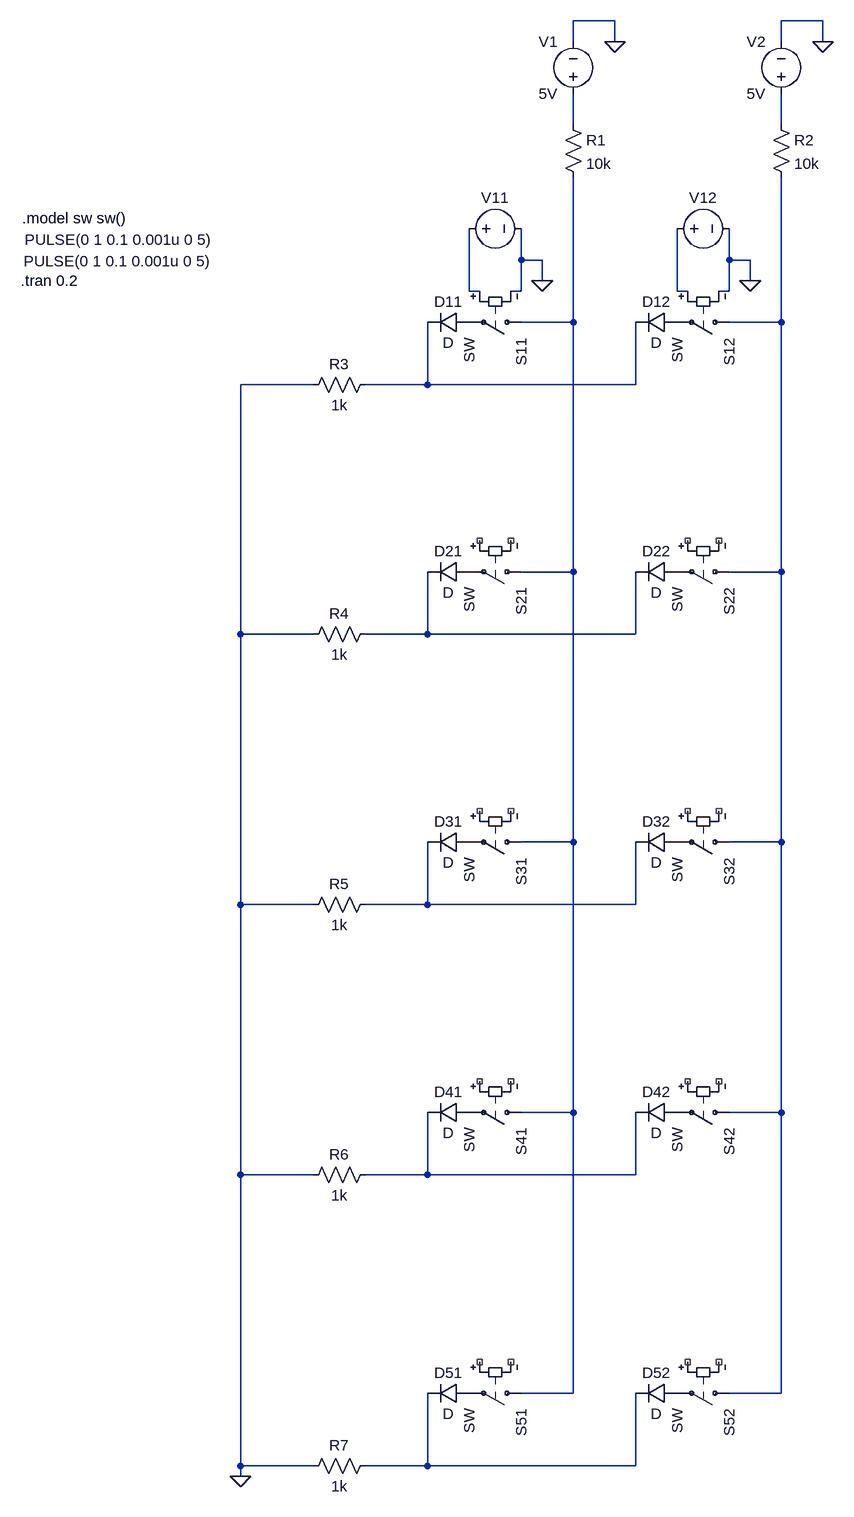
[diagram p0: schematic BGK.asc]
BGK.asc, the LTspice schematic file:
Version 4
SHEET 1 880 2072
WIRE 304 -224 240 -224
WIRE 624 -224 560 -224
WIRE 240 -192 240 -224
WIRE 304 -192 304 -224
WIRE 560 -192 560 -224
WIRE 624 -192 624 -224
WIRE 240 -64 240 -112
WIRE 560 -64 560 -112
WIRE 160 144 160 96
WIRE 192 144 160 144
WIRE 480 144 480 96
WIRE 512 144 480 144
WIRE 192 176 192 144
WIRE 512 176 512 144
WIRE 80 192 80 96
WIRE 96 192 80 192
WIRE 160 192 160 144
WIRE 160 192 144 192
WIRE 400 192 400 96
WIRE 416 192 400 192
WIRE 480 192 480 144
WIRE 480 192 464 192
WIRE 240 240 240 16
WIRE 240 240 160 240
WIRE 560 240 560 16
WIRE 560 240 480 240
WIRE -160 336 -272 336
WIRE 16 336 16 240
WIRE 16 336 -80 336
WIRE 336 336 336 240
WIRE 336 336 16 336
WIRE 240 624 240 240
WIRE 240 624 160 624
WIRE 560 624 560 240
WIRE 560 624 480 624
WIRE -272 720 -272 336
WIRE -160 720 -272 720
WIRE 16 720 16 624
WIRE 16 720 -80 720
WIRE 336 720 336 624
WIRE 336 720 16 720
WIRE 240 1040 240 624
WIRE 240 1040 160 1040
WIRE 560 1040 560 624
WIRE 560 1040 480 1040
WIRE -272 1136 -272 720
WIRE -160 1136 -272 1136
WIRE 16 1136 16 1040
WIRE 16 1136 -80 1136
WIRE 336 1136 336 1040
WIRE 336 1136 16 1136
WIRE 240 1456 240 1040
WIRE 240 1456 160 1456
WIRE 560 1456 560 1040
WIRE 560 1456 480 1456
WIRE -272 1552 -272 1136
WIRE -160 1552 -272 1552
WIRE 16 1552 16 1456
WIRE 16 1552 -80 1552
WIRE 336 1552 336 1456
WIRE 336 1552 16 1552
WIRE 240 1888 240 1456
WIRE 240 1888 160 1888
WIRE 560 1888 560 1456
WIRE 560 1888 480 1888
WIRE -272 2000 -272 1552
WIRE -160 2000 -272 2000
WIRE 16 2000 16 1888
WIRE 16 2000 -80 2000
WIRE 336 2000 336 1888
WIRE 336 2000 16 2000
WIRE -272 2016 -272 2000
FLAG 304 -192 0
FLAG 624 -192 0
FLAG -272 2016 0
FLAG 192 176 0
FLAG 512 176 0
SYMBOL voltage 240 -96 R180
WINDOW 0 24 96 Left 2
WINDOW 3 24 16 Left 2
WINDOW 123 0 0 Left 0
WINDOW 39 0 0 Left 0
SYMATTR InstName V1
SYMATTR Value 5V
SYMBOL diode 80 224 R90
WINDOW 0 0 32 VBottom 2
WINDOW 3 32 32 VTop 2
SYMATTR InstName D11
SYMBOL diode 80 608 R90
WINDOW 0 0 32 VBottom 2
WINDOW 3 32 32 VTop 2
SYMATTR InstName D21
SYMBOL diode 80 1024 R90
WINDOW 0 0 32 VBottom 2
WINDOW 3 32 32 VTop 2
SYMATTR InstName D31
SYMBOL diode 80 1440 R90
WINDOW 0 0 32 VBottom 2
WINDOW 3 32 32 VTop 2
SYMATTR InstName D41
SYMBOL diode 80 1872 R90
WINDOW 0 0 32 VBottom 2
WINDOW 3 32 32 VTop 2
SYMATTR InstName D51
SYMBOL diode 400 256 M270
WINDOW 0 32 32 VTop 2
WINDOW 3 0 32 VBottom 2
SYMATTR InstName D12
SYMBOL diode 400 640 M270
WINDOW 0 32 32 VTop 2
WINDOW 3 0 32 VBottom 2
SYMATTR InstName D22
SYMBOL diode 400 1056 M270
WINDOW 0 32 32 VTop 2
WINDOW 3 0 32 VBottom 2
SYMATTR InstName D32
SYMBOL diode 400 1472 M270
WINDOW 0 32 32 VTop 2
WINDOW 3 0 32 VBottom 2
SYMATTR InstName D42
SYMBOL diode 400 1904 M270
WINDOW 0 32 32 VTop 2
WINDOW 3 0 32 VBottom 2
SYMATTR InstName D52
SYMBOL sw 176 240 R90
SYMATTR InstName S11
SYMBOL sw 176 624 R90
SYMATTR InstName S21
SYMBOL sw 176 1040 R90
SYMATTR InstName S31
SYMBOL sw 176 1456 R90
SYMATTR InstName S41
SYMBOL sw 176 1888 R90
SYMATTR InstName S51
SYMBOL sw 496 1888 R90
SYMATTR InstName S52
SYMBOL sw 496 1456 R90
SYMATTR InstName S42
SYMBOL sw 496 1040 R90
SYMATTR InstName S32
SYMBOL sw 496 624 R90
SYMATTR InstName S22
SYMBOL sw 496 240 R90
SYMATTR InstName S12
SYMBOL res 224 -80 R0
SYMATTR InstName R1
SYMATTR Value 10k
SYMBOL voltage 560 -96 R180
WINDOW 0 24 96 Left 2
WINDOW 3 24 16 Left 2
WINDOW 123 0 0 Left 0
WINDOW 39 0 0 Left 0
SYMATTR InstName V2
SYMATTR Value 5V
SYMBOL res 544 -80 R0
SYMATTR InstName R2
SYMATTR Value 10k
SYMBOL voltage 64 96 R270
WINDOW 0 32 56 VTop 2
WINDOW 3 -1 -523 VBottom 2
WINDOW 123 0 0 Left 0
WINDOW 39 0 0 Left 0
SYMATTR InstName V11
SYMATTR Value PULSE(0 1 0.1 0.001u 0 5)
SYMBOL voltage 384 96 R270
WINDOW 0 32 56 VTop 2
WINDOW 3 -34 -844 VBottom 2
WINDOW 123 0 0 Left 0
WINDOW 39 0 0 Left 0
SYMATTR InstName V12
SYMATTR Value PULSE(0 1 0.1 0.001u 0 5)
SYMBOL res -64 320 R90
WINDOW 0 0 56 VBottom 2
WINDOW 3 32 56 VTop 2
SYMATTR InstName R3
SYMATTR Value 1k
SYMBOL res -64 704 R90
WINDOW 0 0 56 VBottom 2
WINDOW 3 32 56 VTop 2
SYMATTR InstName R4
SYMATTR Value 1k
SYMBOL res -64 1120 R90
WINDOW 0 0 56 VBottom 2
WINDOW 3 32 56 VTop 2
SYMATTR InstName R5
SYMATTR Value 1k
SYMBOL res -64 1536 R90
WINDOW 0 0 56 VBottom 2
WINDOW 3 32 56 VTop 2
SYMATTR InstName R6
SYMATTR Value 1k
SYMBOL res -64 1984 R90
WINDOW 0 0 56 VBottom 2
WINDOW 3 32 56 VTop 2
SYMATTR InstName R7
SYMATTR Value 1k
TEXT -608 80 Left 2 !.model sw sw()
TEXT -610 176 Left 2 !.tran 0.2

The netlist it stands for:
* BGK.asc
V1 N001 0 5V
D11 P001 N007 D
D21 P002 N008 D
D31 P003 N009 D
D41 P004 N010 D
D51 P005 N011 D
D12 P006 N007 D
D22 P007 N008 D
D32 P008 N009 D
D42 P009 N010 D
D52 P010 N011 D
S11 N005 P001 N003 0 SW
S21 N005 P002 NC_01 NC_02 SW
S31 N005 P003 NC_03 NC_04 SW
S41 N005 P004 NC_05 NC_06 SW
S51 N005 P005 NC_07 NC_08 SW
S52 N006 P010 NC_09 NC_10 SW
S42 N006 P009 NC_11 NC_12 SW
S32 N006 P008 NC_13 NC_14 SW
S22 N006 P007 NC_15 NC_16 SW
S12 N006 P006 N004 0 SW
R1 N001 N005 10k
V2 N002 0 5V
R2 N002 N006 10k
V11 N003 0 PULSE(0 1 0.1 0.001u 0 5)
V12 N004 0 PULSE(0 1 0.1 0.001u 0 5)
R3 N007 0 1k
R4 N008 0 1k
R5 N009 0 1k
R6 N010 0 1k
R7 N011 0 1k
.model D D
.lib standard.dio
.model sw sw()
.tran 0.2
.backanno
.end